# EAGLE design monotribemidi (EAGLE 7.1.0)
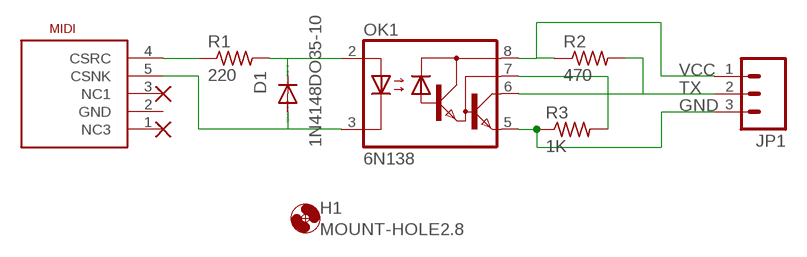
[diagram p0: schematic, sheet 1]

## Parts
D1  1N4148DO35-10  [DO35-10]
H1  MOUNT-HOLE2.8  [2,8]
JP1  M03LOCK  [1X03_LOCK]
MIDI  MIDI_CONN_FEMALE_SUPPORT  [DIN_5_FEMALE_SUPPORT]
OK1  6N138  [DIL08]
R1  220  R-US_0207/12  [0207/12]
R2  470  R-US_0207/12  [0207/12]
R3  1K  R-US_0207/12  [0207/12]

## Nets
GND: JP1.3 OK1.5(GND) R3.1
N$1: MIDI.4(CSRC) R1.1
N$2: D1.C OK1.2(A) R1.2
N$3: D1.A MIDI.5(CSNK) OK1.3(C)
N$5: OK1.7(VB) R3.2
TX: JP1.2 OK1.6(VO) R2.2
VCC: JP1.1 OK1.8(VCC) R2.1
Unconnected: MIDI.1(NC3) MIDI.2(GND) MIDI.3(NC1)

## Library data of the parts
D1 = diode:1N4148: DIODE high speed (Philips)
H1 = holes:MOUNT-HOLE: MOUNTING HOLE with drill center marker
JP1 = SparkFun-Connectors:M03: Header 3 Standard 3-pin 0.1" header. Use with straight break away headers (SKU : PRT-00116), right angle break away headers (PRT-00553), swiss pins (PRT-00743), machine pins (PRT-00117), and female headers (PRT-00115). Molex polarized connector foot print use with SKU : PRT-08232 with associated crimp pins and housings.
MIDI = SparkFun-Connectors:MIDI_CONN_FEMALE_SUPPORT: MIDI connector with strain relief (DIN-5 female)
OK1 = optocoupler:6N138: MOTOROLA OPTO COUPLER; MF: VISHAY/TELEFUNKEN; MPN: 6N138; OC_FARNELL: 9860150; OC_NEWARK: 35K5294
R1-R3 = resistor:R-US_: RESISTOR, American symbol

## Board
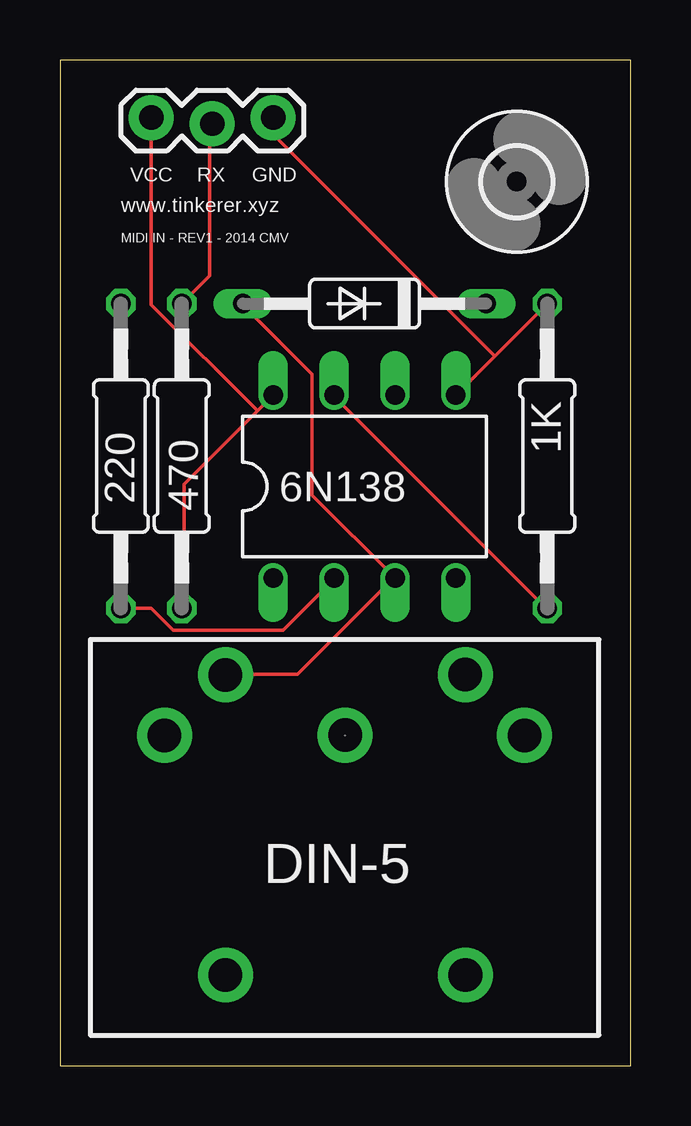
[diagram p1: board, top side]
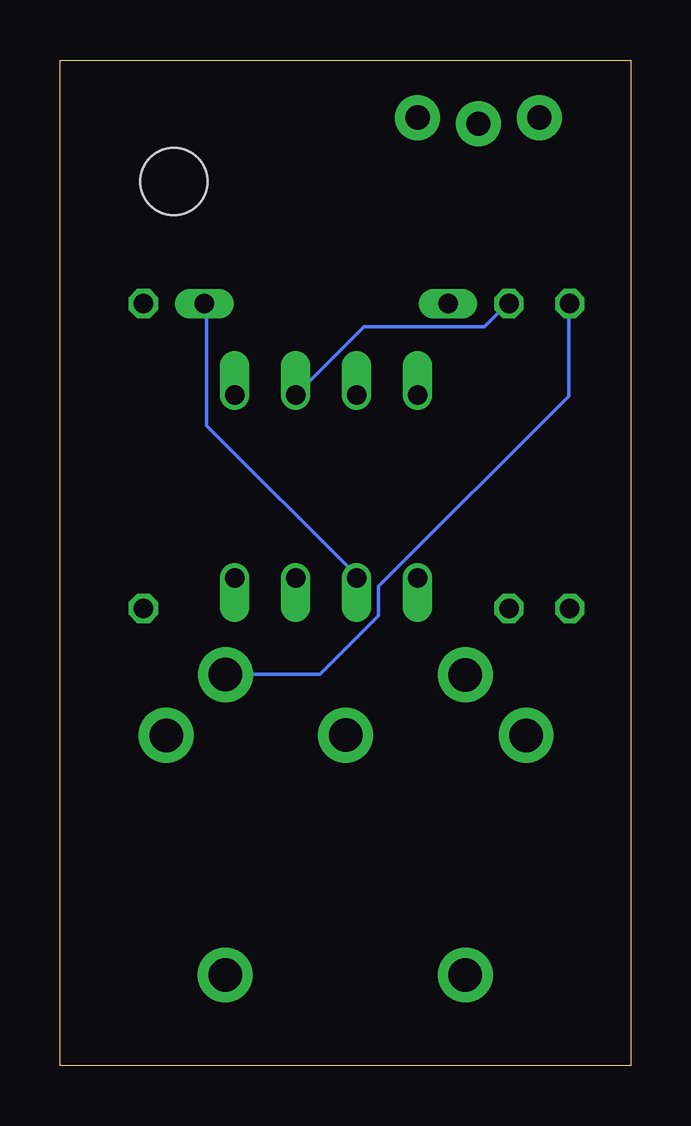
[diagram p2: board, bottom side, seen from below]

Size 23.8 x 41.9 mm. Coordinates in mm from the lower left corner, seen from the top.
Outline: 0,0 23.8,0 23.8,41.9 0,41.9 0,0
Copper layers (1*16): Top 0.0356mm / dielectric 1.5011mm / Bottom 0.0356mm
Design rules "LaenPCBOrder": minimum track width 6mil, minimum drill 13mil, track to track 6mil, track to pad 6mil, pad to pad 6mil, via to via 6mil, smd to smd 6mil, copper to edge 15mil, drill to drill 6mil, minimum pad ring 7mil, minimum via ring 7mil, stop-mask expansion 3mil, vias tented up to drill 0mil, thermal gap 10mil

### Footprints (pad centres in the part's own frame; a part is rotated, then mirrored left to right if it is on the bottom)
DO35-10 = drill 0.813 long: A 5.08,0; C -5.08,0
2,8 = hole 2.8: 0,0
1X03_LOCK = drill 1.016 pad 1.88: 1 0,0.127; 2 2.54,-0.127; 3 5.08,0.127
DIN_5_FEMALE_SUPPORT = drill 1.4 pad 2.286: 1 7.94,3.6; 2 0.46,3.61; 3 -7.07,3.6; 4 5.47,6.13; 5 -4.53,6.12; 6 -4.53,-6.382; 7 5.478,-6.382
DIL08 = drill 0.813 offset: 1 -3.81,-3.81; 2 -1.27,-3.81; 3 1.27,-3.81; 4 3.81,-3.81; 5 3.81,3.81; 6 1.27,3.81; 7 -1.27,3.81; 8 -3.81,3.81
0207/12 = drill 0.813 octagon: 1 -6.35,0; 2 6.35,0

### Placement (x,y rotation side)
D1  12.7,31.75 180 top
H1  19.05,36.83 0 top
JP1  3.81,39.37 0 top
MIDI  11.43,10.16 0 top
OK1  12.7,24.13 0 top
R1  2.54,25.4 270 top
R2  5.08,25.4 90 top
R3  20.32,25.4 270 top

### Tracks (layer width: path | path; a pad name or v marks a point on that pad's centre or on a via)
GND
  Top 0.152: R3.1 18.14,29.57 | 18.14,29.57 OK1.5 | 18.14,29.57 8.99,38.71 8.99,39.47 JP1.3
N$1
  Bottom 0.152: R1.1 2.59,31.7 2.59,27.89 10.52,19.96 10.52,18.75 12.95,16.31 16.76,16.31 MIDI.4
N$2
  Top 0.152: R1.2 3.81,19.05 4.72,18.14 9.3,18.14 11.43,20.27 OK1.2
  Bottom 0.152: D1.C 17.68,31.7 17.68,26.67 11.43,20.42 OK1.2
N$3
  Top 0.152: MIDI.5 7.01,16.31 9.91,16.31 13.87,20.27 OK1.3 10.52,23.77 10.52,28.8 7.62,31.7 D1.A
N$5
  Top 0.152: OK1.7 11.43,27.89 20.27,19.05 R3.2
TX
  Top 0.152: R2.2 6.25,32.92 6.25,39.17 JP1.2
  Bottom 0.152: OK1.6 11.12,30.79 6.1,30.79 5.18,31.7 R2.2
VCC
  Top 0.152: OK1.8 8.23,27.28 | 8.23,27.28 5.18,24.23 5.18,19.05 R2.1 | JP1.1 3.81,31.7 8.23,27.28

### Text on the board
tPlace: VCC | RX | GND | www.tinkerer.xyz | MIDI IN - REV1 - 2014 CMV